# Altium schematic sheet POWER.SchDoc: POWER
size A4; DocumentNumber: 10; Revision: 2.0; SheetNumber: 10; SheetTotal: 18
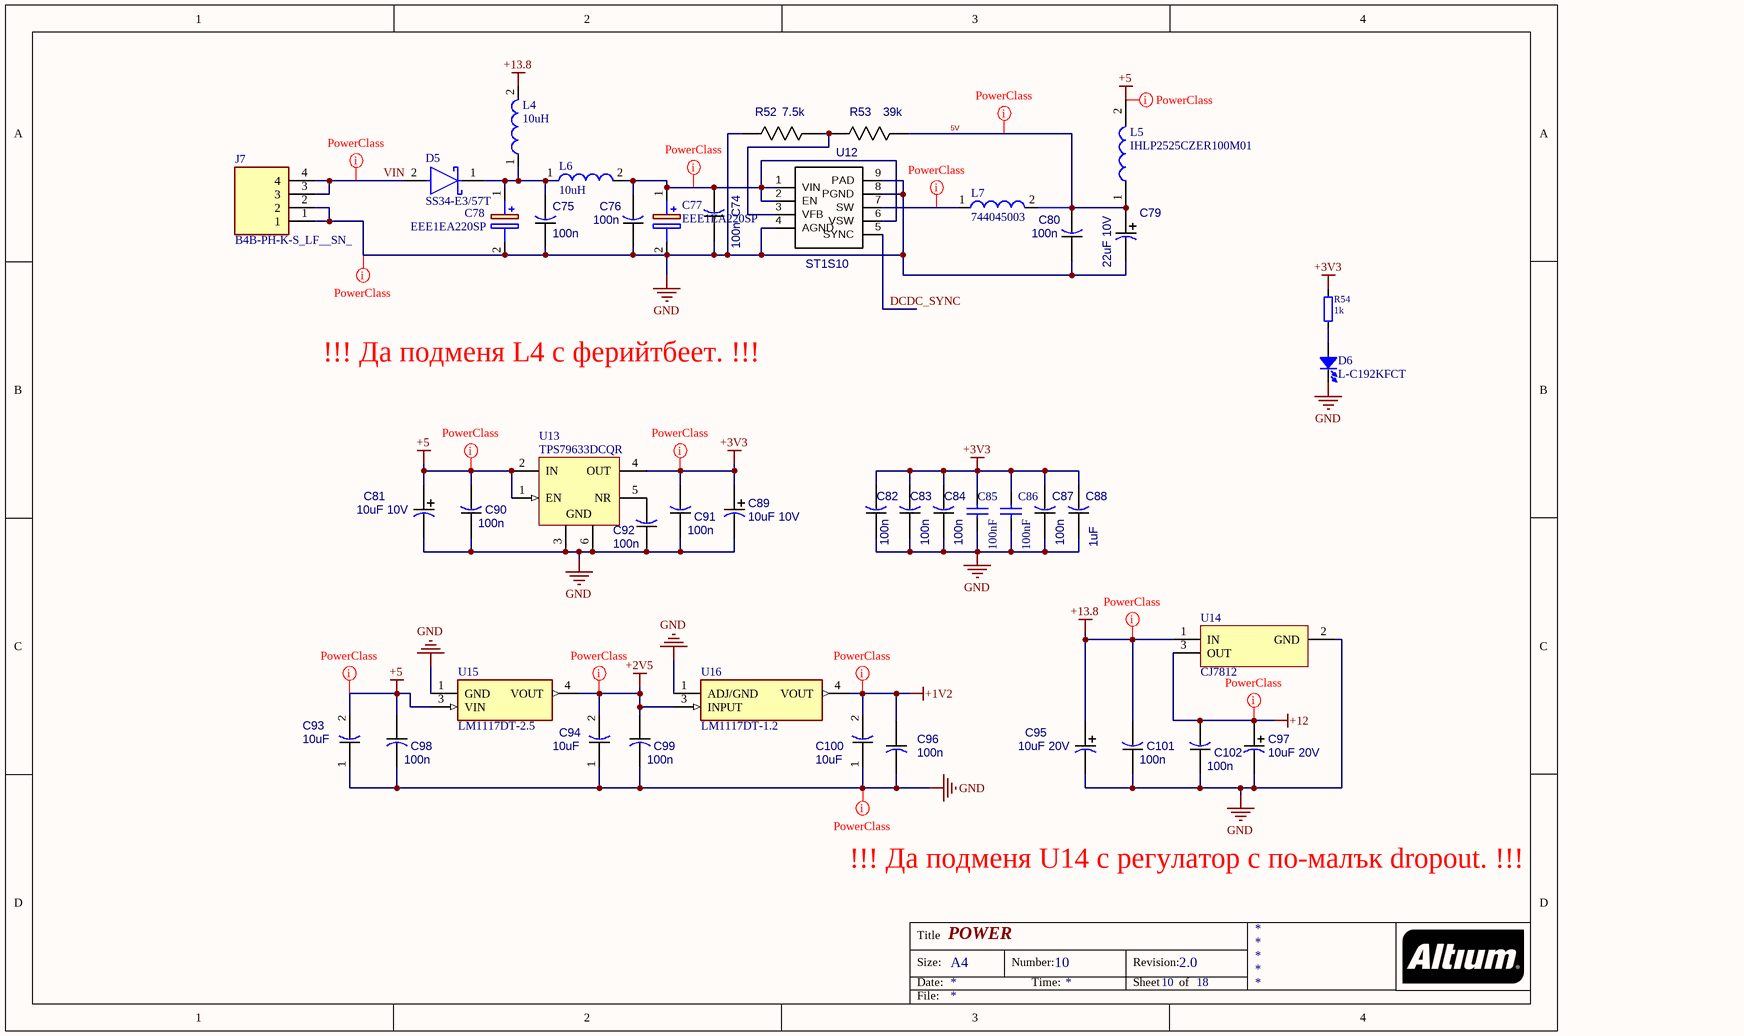
[diagram p0: POWER.SchDoc]

## Parts
C74  100n  [CAP_0805]
C75  100n  [CAP_0805]
C76  100n  [CAP_0805]
C77  EEE1EA220SP  [EEE1AA101SP]
C78  EEE1EA220SP  [EEE1AA101SP]
C79  22uF 10V  [CAPAE_4.3x4.3h5.4]
C80  100n  [CAP_0805]
C81  10uF 10V  [CAPAE_4.3x4.3h5.4]
C82  100n  [CAP_0805]
C83  100n  [CAP_0805]
C84  100n  [CAP_0805]
C85  100nF  [C-0603]
C86  100nF  [C-0603]
C87  100n  [CAP_0805]
C88  value 1uF  [CAP_0805]  (hidden comment: 10uF)
C89  10uF 10V  [CAPAE_4.3x4.3h5.4]
C90  100n  [CAP_0805]
C91  100n  [CAP_0805]
C92  100n  [CAP_0805]
C93  10uF  [CAP_0805]
C94  10uF  [CAP_0805]
C95  10uF 20V  [CAPAE_4.3x4.3h5.4]
C96  100n  [CAP_0805]
C97  10uF 20V  [CAPAE_4.3x4.3h5.4]
C98  100n  [CAP_0805]
C99  100n  [CAP_0805]
C100  10uF  [CAP_0805]
C101  100n  [CAP_0805]
C102  100n  [CAP_0805]
D5  SS34-E3/57T  [FP-95402-MFG]
D6  L-C192KFCT  [LED 0603]
J7  B4B-PH-K-S_LF__SN_  [SHDR4W50P0X200_1X4_990X450X600P]
L4  10uH  [WE-LQ-L]
L5  IHLP2525CZER100M01  [INDPM6965X300N]
L6  10uH  [WE-LQ-L]
L7  744045003  [WE-LQ-L]
R52  7.5k  [RES_0805]
R53  39k  [RES_0805]
R54  1k  [R-0805]
U12  ST1S10  [ST1S10]
U13  TPS79633DCQR  [DCQ0006A_L]
U14  CJ7812  [TO-252-2L]
U15  LM1117DT-2.5  [TO228P991X238-3N]
U16  LM1117DT-1.2  [TO228P991X238-3N]

## Nets
+1V2: C96.1 C100.2 U16.4(VOUT)
+2V5: C94.2 C99.1 U15.4(VOUT) U16.3(INPUT)
+3V3: C82.2 C83.2 C84.2 C85.1 C86.1 C87.2 C88.2 C89.1(PLUS) C91.2 R54.2 U13.4(OUT)
+5: C81.1(PLUS) C90.2 C93.2 C98.1 L5.2 U13.1(EN) U13.2(IN) U15.3(VIN)
+12: C97.1(PLUS) C102.2 U14.3(OUT)
+13.8: C95.1(PLUS) C101.2 L4.2 U14.1(IN)
GND: C74.1 C75.1 C76.1 C77.2(-) C78.2(-) C79.2(MINUS) C80.1 C81.2(MINUS) C82.1 C83.1 C84.1 C85.2 C86.2 C87.1 C88.1 C89.2(MINUS) C90.1 C91.1 C92.1 C93.1 C94.1 C95.2(MINUS) C96.2 C97.2(MINUS) C98.2 C99.2 C100.1 C101.1 C102.1 D6.2 J7.1 J7.2 R52.1 U12.4(AGND) U12.8(PGND) U12.9(PAD) U13.3(GND) U13.6(GND) U14.2(GND) U15.1(GND) U16.1(ADJ/GND)
5V: C79.1(PLUS) C80.2 L5.1 L7.2 R53.2
DCDC_SYNC: U12.5(SYNC)
VIN: D5.2(A) J7.3 J7.4
NetC74_2: C74.2 C76.2 C77.1(+) L6.2 U12.1(VIN) U12.2(EN) U12.6(VSW)
NetC75_2: C75.2 C78.1(+) D5.1(C) L4.1 L6.1
NetC92_2: C92.2 U13.5(NR)
NetD6_1: D6.1 R54.1
NetL7_1: L7.1 U12.7(SW)
NetR52_2: R52.2 R53.1 U12.3(VFB)

## Layout directives
net class PowerPads: 5V, +1V2, +2V5, +3V3, +5, +12, +13.8, GND, NetC74_2, NetL7_1, VIN

## Notes on the sheet
- !!! Да подменя L4 с ферийтбеет. !!!
- !!! Да подменя U14 с регулатор с по-малък dropout. !!!
- Title
- Size:
- Date:
- A4
- Number:
- Time:
- Revision:
- Sheet
- of
- File:

## Library data of the parts
C74-C76 C80 C82-C84 C87 C88 C90-C94 C96 C98-C102 = CAP_0805
  C74-C76 C80 C82-C84 C87 C90-C92 C96 C98 C99 C101 C102: Value: 100n
  C93 C94 C100: Value: 10uF
C77 C78 = EEE1EA220SP: Capacitor Polarised; Manufacturer_Name: Panasonic; Datasheet Link: http://industrial.panasonic.com/cdbs/www-data/pdf/RDE0000/ABA0000C1145.pdf; Height: 7.8mm; Manufacturer_Part_Number: EEE1EA220SP
C79 C81 C89 C95 C97 = CAPAE_4.3x4.3h5.4
  C79: Value: 22uF 10V
  C81 C89: Value: 10uF 10V
  C95 C97: Value: 10uF 20V
C85 C86 = C semi: Ceramic Multilayer Capacitor; Manufacturer: Yageo/Phycomp; Manufacturer P/N: CC0603KRX7R9BB104; numsch: 011; TypeNum: 155; Parameters: 100nF, X7R, 50V, ±10%; Tolerance: ±10%; Voltage: *
D5 = CMP-02539-000012-1: DIODE SCHOTTKY 40V 3A DO214AB; Manufacturer: Vishay; Max Junction Temp: +150°C; Peak Reverse Current: 0.5mA; Max Surge Forward Current: 100A; Standoff Height: 0mm; ComponentLink2Description: Datasheet; Device Class L3: Schottky Diodes; Height: 2.62mm; Max Repetitive Reverse Voltage: 40V; Lead Free: Yes; Package: 95402; Temperature Range High: +150°C; ComponentLink2URL: http://www.vishay.com/docs/88751/ss32.pdf; Temperature: -55°C to +150°C; Footprint Url: http://www.vishay.com/docs/95402/smc.pdf; Automotive: No; Forward Current: 3A; Category: Diode; Manufacturer Part Number: SS34-E3/57T; RoHS: TRUE; Device Class L2: Diodes; Mouser Description: Schottky Diodes & Rectifiers 3.0 Amp 40 Volt; Octopart: https://octopart.com/ss34-e3%2F57t-vishay-39552907; Temperature Range Low: -55°C; Device Class L1: Discrete Semiconductors; Digikey Description: DIODE SCHOTTKY 40V 3A DO214AB
D6 = D LED: SMD LED Diode; Manufacturer: Paralight; Manufacturer P/N: L-C192KFCT
J7 = B4B-PH-K-S_LF__SN_: Connector; Manufacturer_Name: JST (JAPAN SOLDERLESS TERMINALS); Manufacturer_Part_Number: B4B-PH-K-S(LF)(SN); Datasheet Link: https://datasheet.lcsc.com/szlcsc/JST-Sales-America-B4B-PH-K-S-LF-SN_C131334.pdf; Height: 6mm; Arrow Part Number: B4B-PH-K-S(LF)(SN); Arrow Price/Stock: https://www.arrow.com/en/products/b4b-ph-k-s-lf-sn/jst-manufacturing
L4 L6 L7 = CMP-0227-00587-1: SMD-RF-Inductor WE-LQ, L = 3.30 µH; Inductance: 3.30 ÂµH; ComponentLink2URL: http://www.we-online.de/katalog/media/pdf/744045003.pdf; ComponentLink2Description: Datasheet; PackageDescription: Inductor, 2-Leads, Body 4.5 x 3.2 mm; PackageReference: WE-LQ-L; DatasheetVersion: ver 3, Jul-2006; ComponentLink1URL: http://www.we-online.com; ComponentLink1Description: Manufacturer Link; PackageVersion: 2006
L5 = IHLP2525CZER100M01: Inductor; Manufacturer_Name: Vishay; Datasheet Link: https://www.vishay.com/docs/34104/ihlp-2525cz-01.pdf; Height: 3mm; Manufacturer_Part_Number: IHLP2525CZER100M01; Mouser Part Number: 70-IHLP2525CZER100M0; Mouser Price/Stock: https://www.mouser.co.uk/ProductDetail/Vishay-Dale/IHLP2525CZER100M01?qs=PA%252BPfIdQ8xl3JLrMc5InbA%3D%3D; Arrow Part Number: IHLP2525CZER100M01; Arrow Price/Stock: https://www.arrow.com/en/products/ihlp2525czer100m01/vishay?region=nac
R52 R53 = RES_0805
  R52: Value: 7.5k
  R53: Value: 39k
R54 = RES semi: Chip Resistor; Manufacturer: Yageo/Phycomp; Manufacturer P/N: RC0603FR-0749R9L; numsch: 021; TypeNum: 212; Parameters: 49.9R, RC, 0.1W, ±1%, TCR ±100ppm; Power: *; TCR: *; Series: *; Tolerance: *
U13 = CMP-0395-00327-2: Single Output High PSRR LDO, 1 A, Fixed 3.3 V Output, 2.7 to 5.5 V Input, 6-pin SOT-223 (DCQ), -40 to 125 degC, Green (RoHS & no Sb/Br); Manufacturer: Texas Instruments; Accuracy(%): 2; Iout(Max)(A): 1; Vdo(Typ)(mV): 220; SubFamily: Single Channel LDO; Vout Adj(Min)(V): 3.3; Vin(Max)(V): 5.5; Iq(Typ)(mA): 0.26; Vin(Min)(V): 2.7; DatasheetVersion: SLVS351N; ComponentLink2Description: Datasheet; PartNumber: TPS79633DCQR; PackageDescription: 6-Pin Plastic Small Outline, Body 3.5 x 6.5 mm, Pitch 1.27 mm; ComponentLink1Description: Manufacturer URL; ComponentLink2URL: http://www.ti.com/general/docs/lit/getliterature.tsp?genericPartNumber=TPS79633&fileType=pdf; ComponentLink3URL: http://www.ti.com/litv/pdf/mpds098c; Mounting Technology: Surface Mount; Fixed Output Options(V): 3.3; PackageReference: DCQ0006A; ComponentLink1URL: http://www.ti.com/; PackageVersion: 4202109/D; ComponentLink3Description: Package Specification; Vout Adj(Max)(V): 3.3; Eco-Plan: Green (RoHS & no Sb/Br)
U15 = LM1117DT-2.5: Integrated Circuit; Manufacturer_Name: Texas Instruments; Datasheet Link: https://datasheet.datasheetarchive.com/originals/distributors/Datasheets-22/DSA-425562.pdf; Height: 2.38mm; Manufacturer_Part_Number: LM1117DT-2.5; Mouser Part Number: 926-LM1117DT-25; Mouser Price/Stock: https://www.mouser.com/Search/Refine.aspx?Keyword=926-LM1117DT-25
U16 = LM1117DT-1.8: Integrated Circuit; Manufacturer_Name: Texas Instruments; Datasheet Link: https://datasheet.datasheetarchive.com/originals/distributors/SFDatasheet-3/sf-00077938.pdf; Height: 2.38mm; Manufacturer_Part_Number: LM1117DT-1.8; Mouser Part Number: 926-LM1117DT-18; Mouser Price/Stock: https://www.mouser.com/Search/Refine.aspx?Keyword=926-LM1117DT-18
U12 = ST1S10: Value: ST1S10